# EAGLE design SNES-GamePad (EAGLE 6.2)
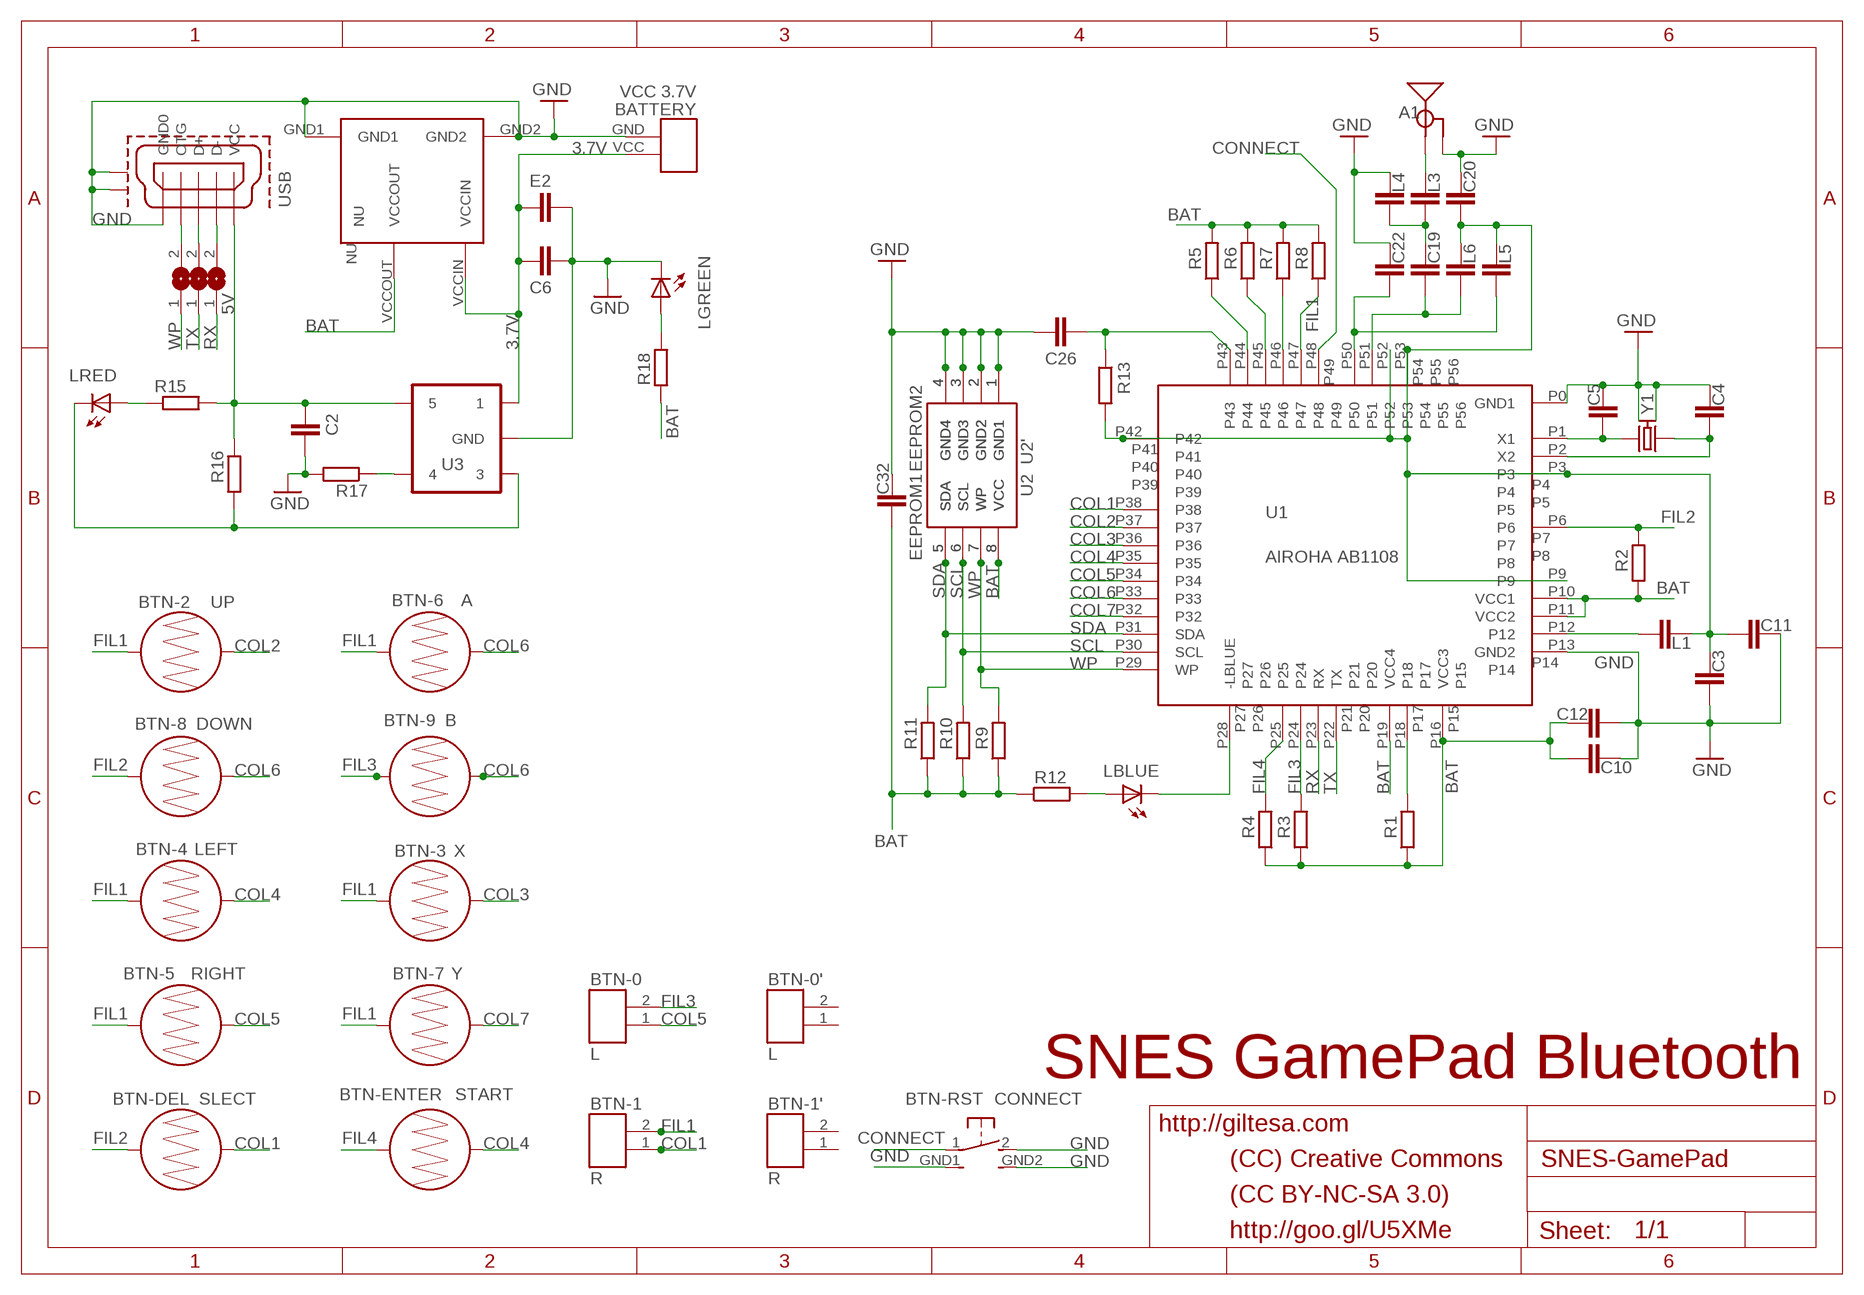
[diagram p0: schematic, sheet 1]

## Parts
A1  ANTENA  ANTENA-AIROHA  [ANTENA-AIROHA]
BATTERY  VCC 3.7V  1X02_SMD_BIG  [1X02_SMD_BIG]
BTN-0  L  1X02_SMD  [1X02_SMD]
BTN-0'  L  SNES_GAMEPAD_RL  [SNES_GAMEPAD_RL]
BTN-1  R  1X02_SMD  [1X02_SMD]
BTN-1'  R  SNES_GAMEPAD_RL  [SNES_GAMEPAD_RL]
BTN-2  UP  BUTTON-CONDUCTIVE-PAD  [BUTTON-CONDUCTIVE-PAD]
BTN-3  X  BUTTON-CONDUCTIVE-BUTTON  [BUTTON-CONDUCTIVE-BUTTON]
BTN-4  LEFT  BUTTON-CONDUCTIVE-PAD  [BUTTON-CONDUCTIVE-PAD]
BTN-5  RIGHT  BUTTON-CONDUCTIVE-PAD  [BUTTON-CONDUCTIVE-PAD]
BTN-6  A  BUTTON-CONDUCTIVE-BUTTON  [BUTTON-CONDUCTIVE-BUTTON]
BTN-7  Y  BUTTON-CONDUCTIVE-BUTTON  [BUTTON-CONDUCTIVE-BUTTON]
BTN-8  DOWN  BUTTON-CONDUCTIVE-PAD  [BUTTON-CONDUCTIVE-PAD]
BTN-9  B  BUTTON-CONDUCTIVE-BUTTON  [BUTTON-CONDUCTIVE-BUTTON]
BTN-DEL  SLECT  BUTTON-CONDUCTIVE-BUTTON  [BUTTON-CONDUCTIVE-BUTTON]
BTN-ENTER  START  BUTTON-CONDUCTIVE-BUTTON  [BUTTON-CONDUCTIVE-BUTTON]
BTN-RST  CONNECT  SWITCH-90º  [SWITCH-90º]
C2  C0603  [C0603]
C3  C0603  [C0603]
C4  C0603  [C0603]
C5  C0603  [C0603]
C6  C0603  [C0603]
C10  C0603  [C0603]
C11  C0603  [C0603]
C12  C0603  [C0603]
C19  C0603  [C0603]
C20  C0603  [C0603]
C22  C0603  [C0603]
C26  C0603  [C0603]
C32  C0603  [C0603]
E2  C0805  [C0805]
L1  C1206  [C1206]
L3  C0603  [C0603]
L4  C0603  [C0603]
L5  C0603  [C0603]
L6  C0603  [C0603]
LBLUE  LEDCHIPLED_0805  [CHIPLED_0805]
LGREEN  LEDCHIPLED_0805  [CHIPLED_0805]
LRED  LEDCHIPLED_0805  [CHIPLED_0805]
R1  22kΩ  R0603  [R0603]
R2  22kΩ  R0603  [R0603]
R3  22kΩ  R0603  [R0603]
R4  22kΩ  R0603  [R0603]
R5  22kΩ  R0603  [R0603]
R6  22kΩ  R0603  [R0603]
R7  22kΩ  R0603  [R0603]
R8  22kΩ  R0603  [R0603]
R9  4.7kΩ  R0603  [R0603]
R10  2.2kΩ  R0603  [R0603]
R11  2.2kΩ  R0603  [R0603]
R12  330Ω  R0603  [R0603]
R13  10Ω  R0603  [R0603]
R15  330Ω  R0603  [R0603]
R16  10kΩ  R0603  [R0603]
R17  4.7kΩ  R0603  [R0603]
R18  1kΩ  R0603  [R0603]
S2  INTERRUPTOR_1  [INTERRUPTOR_1]
SJ1  JUMPER-SMD  [JUMPER-SMD]
SJ2  JUMPER-SMD  [JUMPER-SMD]
SJ3  JUMPER-SMD  [JUMPER-SMD]
U1  AIROHA AB1108  QFN56_6MM  [QFN56_6MM]
U2  EEPROM1  EEPROM-BLUETOOTH-SNES  [TSSOP8]
U2'  EEPROM2  EEPROM-BLUETOOTH-SNES2  [M8-EEPROM]
U3  SOT23-5  [SOT23-5]
USB  MICRO_USB_1  [MICRO_USB_1]
Y1  CRISTAL  CRISTAL-SMD-3X2.5MM  [CRISTAL-SMD-3X2.5MM]

## Nets
3.7V: BATTERY.VCC C6.1 E2.1 S2.VCCIN U3.1
5V: C2.1 R15.2 R16.2 U3.5 USB.VCC
BAT: C10.1 C12.1 C32.2 R1.1 R2.1 R3.1 R4.1 R5.2 R6.2 R7.2 R8.2 R9.1 R10.1 R11.1 R12.1 R18.2 S2.VCCOUT U1.P10(VCC1) U1.P11(VCC2) U1.P16(VCC3) U1.P19(VCC4) U2'.8(VCC) U2.8(VCC)
COL1: BTN-1.1 BTN-DEL.2 U1.P38
COL2: BTN-2.2 U1.P37
COL3: BTN-3.1 U1.P36
COL4: BTN-4.1 BTN-ENTER.1 U1.P35
COL5: BTN-0.1 BTN-5.2 U1.P34
COL6: BTN-6.2 BTN-8.2 BTN-9.2 U1.P33
COL7: BTN-7.2 U1.P32
CONNECT: BTN-RST.1 U1.P48
FIL1: BTN-1.2 BTN-2.1 BTN-3.2 BTN-4.2 BTN-5.1 BTN-6.1 BTN-7.1 R8.1 U1.P47
FIL2: BTN-8.1 BTN-DEL.1 R2.2 U1.P6
FIL3: BTN-0.2 BTN-9.1 R3.2 U1.P24
FIL4: BTN-ENTER.2 R4.2 U1.P25
GND: A1.GND BATTERY.GND BTN-RST.2 BTN-RST.GND1 BTN-RST.GND2 C2.2 C3.2 C4.1 C5.1 C6.2 C10.2 C11.1 C12.2 C20.1 C22.1 C26.2 C32.1 E2.2 L4.1 LGREEN.C R17.2 S2.GND1 S2.GND2 U1.P0(GND1) U1.P13(GND2) U2'.1(GND1) U2'.2(GND2) U2'.3(GND3) U2'.4(GND4) U2.1(GND1) U2.2(GND2) U2.3(GND3) U2.4(GND4) U3.2(GND) USB.GND0 USB.GND1 USB.GND2 Y1.GND1 Y1.GND2
N$1: LRED.A R15.1
N$2: C22.2 L5.2 U1.P50
N$3: SJ1.2 USB.OTG
N$4: LGREEN.A R18.1
N$5: C19.1 L3.2 L4.2
N$6: A1.SIGNAL L3.1
N$7: C19.2 L6.2 U1.P51
N$8: SJ3.2 USB.D-
N$9: SJ2.2 USB.D+
N$35: LBLUE.C U1.P28(-LBLUE)
N$36: LRED.C R16.1 U3.3
N$37: R17.1 U3.4
N$39: LBLUE.A R12.2
N$40: C26.1 R13.1 U1.P43
N$45: C3.1 C11.2 C20.2 L1.2 L5.1 L6.1 R13.2 U1.P3 U1.P9 U1.P42 U1.P52 U1.P53
N$46: R1.2 U1.P18
N$48: R5.1 U1.P44
N$49: R6.1 U1.P45
N$50: R7.1 U1.P46
N$52: L1.1 U1.P12
RX: SJ3.1 U1.P23(RX)
SCL: R10.2 U1.P30(SCL) U2'.6(SCL) U2.6(SCL)
SDA: R11.2 U1.P31(SDA) U2'.5(SDA) U2.5(SDA)
TX: SJ2.1 U1.P22(TX)
WP: R9.2 SJ1.1 U1.P29(WP) U2'.7(WP) U2.7(WP)
X1: C5.2 U1.P1(X1) Y1.P2
X2: C4.2 U1.P2(X2) Y1.P1
Unconnected: BTN-0'.1 BTN-0'.2 BTN-1'.1 BTN-1'.2 S2.NU U1.P4 U1.P5 U1.P7 U1.P8 U1.P14 U1.P15 U1.P17 U1.P20 U1.P21 U1.P26 U1.P27 U1.P39 U1.P40 U1.P41 U1.P49 U1.P54 U1.P55 U1.P56

## Notes on the sheet
- SNES GamePad Bluetooth
- http://giltesa.com
- (CC) Creative Commons
- (CC BY-NC-SA 3.0)
- http://goo.gl/U5XMe

## Library data of the parts
A1 = ,giltesa:ANTENA-AIROHA
BATTERY = ,giltesa:1X02_SMD_BIG
BTN-0 BTN-1 = ,giltesa:1X02_SMD
BTN-0' BTN-1' = ,giltesa:SNES_GAMEPAD_RL
BTN-2 BTN-4 BTN-5 BTN-8 = ,giltesa:BUTTON-CONDUCTIVE-PAD
BTN-3 BTN-6 BTN-7 BTN-9 BTN-DEL BTN-ENTER = ,giltesa:BUTTON-CONDUCTIVE-BUTTON
BTN-RST = ,giltesa:SWITCH-90º
C2-C6 C10-C12 C19 C20 C22 C26 C32 L3-L6 = ,giltesa:C0603
E2 = ,giltesa:C0805
L1 = ,giltesa:C1206
LBLUE LGREEN LRED = led:LED: LED OSRAM: - CHIPLED LG R971, LG N971, LY N971, LG Q971, LY Q971, LO R971, LY R971 LH N974, LH R974 LS Q976, LO Q976, LY Q976 LO Q996 - Hyper CHIPLED LW Q18S LB Q993, LB Q99A, LB R99A - SideLED LS A670, LO A670, LY A670, LG A670, LP A670 LB A673, LV A673, LT A673, LW A673 LH A674 LY A675 LS A676, LA A676, LO A676, LY A676, LW A676 LS A679, LY A679, LG A679 - Hyper Micro SIDELED® LS Y876, LA Y876, LO Y876, LY Y876 LT Y87S - SmartLED LW L88C, LW L88S LB L89C, LB L89S, LG L890 LS L89K, LO L89K, LY L89K LS L896, LA L896, LO L896, LY L896 - TOPLED LS T670, LO T670, LY T670, LG T670, LP T670 LSG T670, LSP T670, LSY T670, LOP T670, LYG T670 LG T671, LOG T671, LSG T671 LB T673, LV T673, LT T673, LW T673 LH T674 LS T676, LA T676, LO T676, LY T676, LB T676, LH T676, LSB T676, LW T676 LB T67C, LV T67C, LT T67C, LS T67K, LO T67K, LY T67K, LW E67C LS E67B, LA E67B, LO E67B, LY E67B, LB E67C, LV E67C, LT E67C LW T67C LS T679, LY T679, LG T679 LS T770, LO T770, LY T770, LG T770, LP T770 LB T773, LV T773, LT T773, LW T773 LH T774 LS E675, LA E675, LY E675, LS T675 LS T776, LA T776, LO T776, LY T776, LB T776 LHGB T686 LT T68C, LB T68C - Hyper Mini TOPLED® LB M676 - Mini TOPLED Santana® LG M470 LS M47K, LO M47K, LY M47K Source: http://www.osram.convergy.de LUXEON: - LUMILED® LXK2-PW12-R00, LXK2-PW12-S00, LXK2-PW14-U00, LXK2-PW14-V00 LXK2-PM12-R00, LXK2-PM12-S00, LXK2-PM14-U00 LXK2-PE12-Q00, LXK2-PE12-R00, LXK2-PE12-S00, LXK2-PE14-T00, LXK2-PE14-U00 LXK2-PB12-K00, LXK2-PB12-L00, LXK2-PB12-M00, LXK2-PB14-N00, LXK2-PB14-P00, LXK2-PB14-Q00 LXK2-PR12-L00, LXK2-PR12-M00, LXK2-PR14-Q00, LXK2-PR14-R00 LXK2-PD12-Q00, LXK2-PD12-R00, LXK2-PD12-S00 LXK2-PH12-R00, LXK2-PH12-S00 LXK2-PL12-P00, LXK2-PL12-Q00, LXK2-PL12-R00 Source: www.luxeon.com KINGBRIGHT: KA-3528ASYC Source: www.kingbright.com
R1-R13 R15-R18 = ,giltesa:R0603
S2 = ,giltesa:INTERRUPTOR_1
SJ1-SJ3 = ,giltesa:JUMPER-SMD
U1 = ,giltesa:QFN56_6MM
U2 = ,giltesa:EEPROM-BLUETOOTH-SNES
U2' = ,giltesa:EEPROM-BLUETOOTH-SNES2
U3 = ,giltesa:SOT23-5
USB = ,giltesa:MICRO_USB_1
Y1 = ,giltesa:CRISTAL-SMD-3X2.5MM

## Board
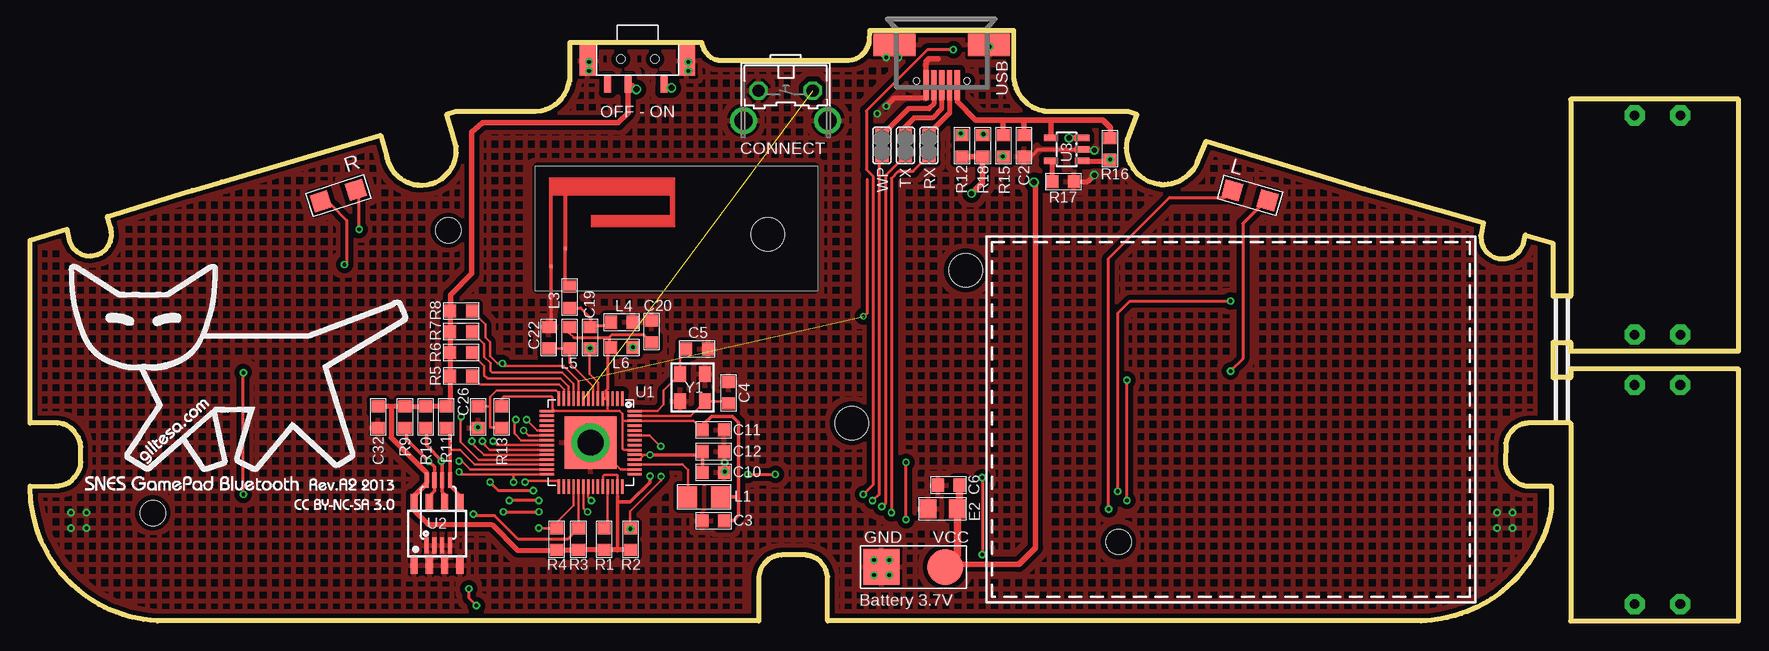
[diagram p1: board, top side]
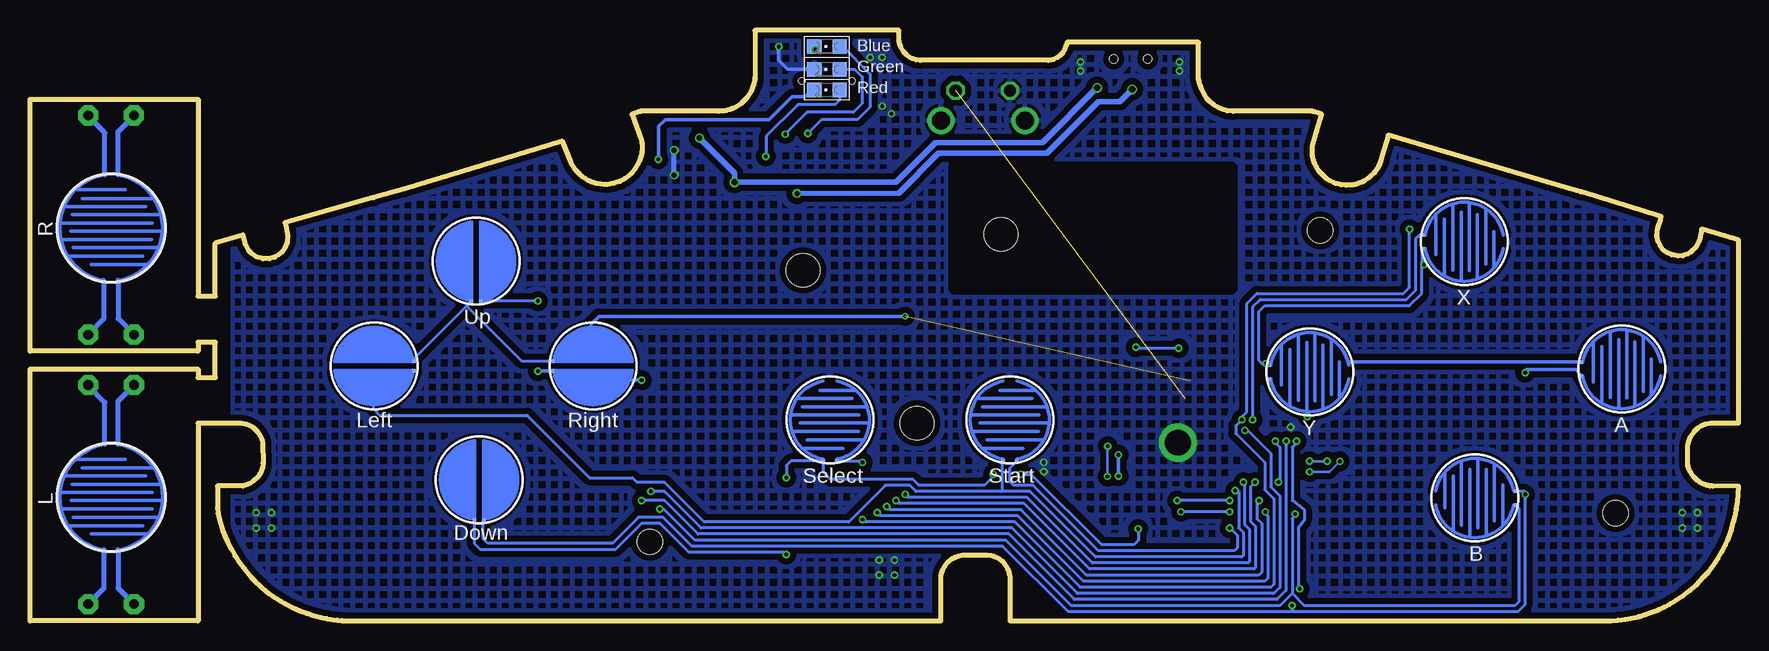
[diagram p2: board, bottom side, seen from below]

Size 142.42 x 49.25 mm. Coordinates in mm from the lower left corner, seen from the top.
Outline: 0,16.48 0,31.75 3.07,32.66 3.28,31.67 3.56,31.14 3.94,30.78 4.22,30.61 4.65,30.45 5.03,30.43 5.59,30.53 5.99,30.73 6.3,30.96 6.53,31.29 6.71,31.62 6.81,32.11 6.78,32.46 6.73,32.77 6.5,33.45 6.45,33.73 13.16,35.79 13.51,35.89 15.95,36.6 29.21,40.49 29.72,38.76 29.77,38.58 29.82,38.38 29.9,38.18 30.12,37.72 30.2,37.62 30.33,37.44 30.43,37.31 30.63,37.11 30.78,36.98 30.91,36.88 31.19,36.7 31.32,36.63 31.52,36.55 31.78,36.45 31.95,36.4 32.08,36.37 32.26,36.35 32.36,36.35 32.72,36.32 33.12,36.37 33.35,36.42 33.55,36.47 33.76,36.55 34.14,36.75 34.32,36.86 34.44,36.96 34.75,37.24 34.98,37.52 35.18,37.85 35.31,38.07 35.43,38.46 35.51,38.79 35.53,39.01 35.53,39.55 35.18,40.77 34.75,42.24 35.51,42.49 42.11,42.49 42.62,42.55 42.95,42.65 43.36,42.8 43.76,43.05 44.07,43.31 44.3,43.56 44.53,43.87 44.75,44.3 44.91,44.75 44.98,45.03 45.01,45.16 45.01,48.25 55.98,48.25 56.03,48.01 56.06,47.96 56.18,47.63 56.34,47.4 56.57,47.14 56.77,46.99 57.07,46.84 57.35,46.76 57.56,46.74 68.22,46.74 68.55,46.79 68.86,46.89 69.11,47.02 69.32,47.17 69.57,47.42 69.67,47.55 69.82,47.83 69.9,48.03 69.95,48.18 69.98,48.34 70,49.25 81.99,49.25 81.99,45.26 82.09,44.7 82.22,44.37 82.32,44.15 82.47,43.89 82.65,43.64 82.93,43.33 83.16,43.13 83.52,42.9 83.79,42.75 84.05,42.65 84.33,42.57 84.58,42.52 85.01,42.49 91.52,42.49 92.25,42.24 91.47,40.16 91.41,39.83 91.39,39.45 91.41,39.14 91.49,38.74 91.57,38.51 91.59,38.38 91.72,38.13 91.97,37.69 92.28,37.31 92.48,37.13 92.84,36.88 93.22,36.65 93.75,36.5 94.11,36.42 94.28,36.4 94.59,36.4 94.87,36.42 95.17,36.47 95.45,36.55 95.66,36.63 95.89,36.73 96.14,36.88 96.37,37.03 96.57,37.21 96.75,37.36 96.9,37.54 97,37.67 97.26,38.07 97.33,38.25 98.04,40.01 111.25,36.02 113.82,35.28 121.16,33.2 120.93,32.13 120.98,31.57 121.16,31.14 121.41,30.76 121.72,30.51 122.02,30.33 122.45,30.2 122.99,30.2 123.55,30.35 123.98,30.66 124.18,30.89 124.46,31.37 124.66,32.18 126.97,31.5 126.97,27.08 128.42,27.08 128.42,43.5 142.42,43.5 142.42,22.5 128.42,22.5 128.42,23.22 126.97,23.22 126.97,20.29 128.42,20.29 128.42,21 142.42,21 142.42,0 128.42,0 128.42,16.48 124.84,16.48 124.61,16.46 124.41,16.41 124.18,16.33 123.88,16.15 123.65,15.98 123.44,15.77 123.24,15.44 123.09,15.11 123.01,14.81 122.99,13.13 123.04,12.78 123.24,12.27 123.42,11.99 123.83,11.63 124.05,11.48 124.49,11.3 124.69,11.25 126.8,11.25 126.8,9.4 126.75,8.94 126.64,8.51 126.34,7.52 126.14,6.99 125.98,6.63 125.7,6.07 125.32,5.41 124.94,4.83 123.98,3.63 123.67,3.33 123.16,2.84 122.78,2.51 122.53,2.31 122.07,1.98 121.79,1.8 121.46,1.6 121.16,1.42 120.62,1.14 120.29,0.99 119.84,0.79 119.33,0.61 118.85,0.46 118.19,0.28 117.65,0.18 116.81,0.05 116.43,0.03 115.98,0 66.5,0 66.5,3.71 66.4,4.09 66.32,4.29 66.19,4.55 65.89,4.93 65.61,5.16 65.33,5.31 65.02,5.41 64.85,5.46 64.67,5.49 62.64,5.49 62.33,5.46 62.1,5.38 61.85,5.28 61.62,5.16 61.42,5 61.19,4.75 60.99,4.47 60.91,4.29 60.86,4.17 60.78,3.86 60.73,3.63 60.73,0 10.64,0 10.06,0.05 9.45,0.13 8.33,0.36 7.72,0.53 7.16,0.74 6.65,0.94 6.17,1.17 5.77,1.37 5.26,1.68 4.65,2.08 4.06,2.54 3.51,3.02 3.23,3.3 2.84,3.71 2.54,4.06 2.29,4.39 1.98,4.8 1.73,5.18 1.4,5.77 1.09,6.32 0.91,6.73 0.61,7.54 0.38,8.33 0.25,8.86 0.18,9.3 0.08,9.93 0,11.23 2.13,11.25 2.36,11.25 2.49,11.28 2.72,11.33 3,11.43 3.25,11.56 3.51,11.73 3.73,11.99 3.91,12.22 4.04,12.45 4.11,12.6 4.22,12.93 4.24,13.23 4.24,14.53 4.19,14.86 4.17,14.96 4.04,15.32 3.66,15.85 3.4,16.08 3.07,16.28 2.77,16.41 2.31,16.48 0,16.48
Copper layers (1*16): Top 0.035mm / dielectric 1.5mm / Bottom 0.035mm
Design rules: minimum track width 6mil, minimum drill 12mil, track to track 6mil, track to pad 6mil, pad to pad 6mil, via to via 6mil, smd to smd 0mil, copper to edge 10mil, drill to drill 10mil, minimum pad ring 10mil, minimum via ring 6mil, stop-mask expansion 2mil, vias tented up to drill 100mil, thermal gap 10mil
Holes 2.8 mm at 61.5,32.24 78,29.24 68.5,16.49
Holes 2.1 mm at 10.25,8.99 90.75,6.59 34.87,32.57

### Footprints (pad centres in the part's own frame; a part is rotated, then mirrored left to right if it is on the bottom)
ANTENA-AIROHA = smd 0.25 x 0.25: GND -10.351,-3.289; SIGNAL -9.152,-1.79
1X02_SMD_BIG = smd 3 x 3: GND -2.75,0; VCC 2.56,0
1X02_SMD = smd 1.5 x 1.5: 1 -1.48,0.02; 2 1.58,0.02
SNES_GAMEPAD_RL = drill 0.8 pad 1.676 octagon: 1 1.27,5.08; 1' 19.55,5.08; 2 1.27,1.27; 2' 19.55,1.27
BUTTON-CONDUCTIVE-PAD = smd 0.305 x 0.305: 1 -3.334,0.396; 2 -3.334,-0.396
BUTTON-CONDUCTIVE-BUTTON = smd 0.305 x 0.305: 1 3.41,-0.577; 2 3.412,0.577
SWITCH-90º = drill 1.016 octagon: 1 -2.261,-1.245; 2 2.261,-1.245 | drill 1.499 pad 2.159: GND1 -3.505,1.245; GND2 3.505,1.245
C0603 = smd 1 x 1.1: 1 -0.901,-0.038; 2 0.901,-0.038
C0805 = smd 1.4 x 1.6: 1 -1.256,-0.025; 2 1.193,-0.025
C1206 = smd 1.6 x 1.8: 1 -1.362,-0.013; 2 1.387,-0.013
CHIPLED_0805 = smd 1.2 x 1.2: A 0,-1.05; C 0,1.05
R0603 = smd 1 x 1.1: 1 -0.901,0.013; 2 0.901,0.013
INTERRUPTOR_1 = smd 1.4 x 2.54: GND1 -0.75,1.232; GND2 7.5,1.232 | smd 0.6 x 1.4: NU 0.9,-0.75; VCCIN 5.6,-0.75; VCCOUT 2.6,-0.75 | hole 0.7: 2,1.36; 4.85,1.36
JUMPER-SMD = smd 1.15 x 1.1: 1 -0.838,0; 2 0.838,0
QFN56_6MM = smd 4.35 x 4.35: P0 0.004,-0.123 | smd 1.2 x 0.203: P1 3.658,2.515; P2 3.658,2.108; P3 3.658,1.702; P4 3.658,1.295; P5 3.658,0.889; P6 3.658,0.483; P7 3.658,0.076; P8 3.658,-0.33; P9 3.658,-0.737; P10 3.658,-1.143; P11 3.658,-1.549; P12 3.658,-1.956; P13 3.658,-2.362; P14 3.658,-2.769; P29 -3.658,-2.769; P30 -3.658,-2.362; P31 -3.658,-1.956; P32 -3.658,-1.549; P33 -3.658,-1.143; P34 -3.658,-0.737; P35 -3.658,-0.33; P36 -3.658,0.076; P37 -3.658,0.483; P38 -3.658,0.889; P39 -3.658,1.295; P40 -3.658,1.702; P41 -3.658,2.108; P42 -3.658,2.515 | smd 0.203 x 1.2: P15 2.642,-3.785; P16 2.235,-3.785; P17 1.829,-3.785; P18 1.422,-3.785; P19 1.016,-3.785; P20 0.61,-3.785; P21 0.203,-3.785; P22 -0.203,-3.785; P23 -0.61,-3.785; P24 -1.016,-3.785; P25 -1.422,-3.785; P26 -1.829,-3.785; P27 -2.235,-3.785; P28 -2.642,-3.785; P43 -2.642,3.531; P44 -2.235,3.531; P45 -1.829,3.531; P46 -1.422,3.531; P47 -1.016,3.531; P48 -0.61,3.531; P49 -0.203,3.531; P50 0.203,3.531; P51 0.61,3.531; P52 1.016,3.531; P53 1.422,3.531; P54 1.829,3.531; P55 2.235,3.531; P56 2.642,3.531
TSSOP8 = smd 1.3 x 0.35: 1 -2.722,0.975; 2 -2.722,0.325; 3 -2.722,-0.325; 4 -2.722,-0.975; 5 2.722,-0.975; 6 2.722,-0.325; 7 2.722,0.325; 8 2.722,0.975
M8-EEPROM = smd 0.6 x 1.4: 1 -1.905,-2.63; 2 -0.635,-2.63; 3 0.635,-2.63; 4 1.905,-2.63; 5 1.905,2.63; 6 0.635,2.63; 7 -0.635,2.63; 8 -1.905,2.63
SOT23-5 = smd 1.2 x 0.55: 1 1.3,0.955; 2 1.3,0; 3 1.3,-0.955; 4 -1.3,-0.955; 5 -1.3,0.955
MICRO_USB_1 = smd 2.5 x 0.45: D+ 3.35,0; D- 3.35,0.65; GND0 3.35,-1.3; OTG 3.35,-0.65; VCC 3.35,1.3 | smd 1.9 x 3.5: GND1 0,3.95; GND2 0,-3.95 | hole 0.5: 3,2.1; 3,-2.1
CRISTAL-SMD-3X2.5MM = smd 1.3 x 1: GND1 -1.046,0.886; GND2 1.237,-1.196; P1 -1.046,-1.196; P2 1.237,0.886

### Placement (x,y rotation side)
A1  53.77,32.85 0 top
BATTERY  73.75,4.49 0 top
BTN-0  101.75,35.49 164 top
BTN-0'  132.49,0.12 90 bottom
BTN-1  25.75,35.49 198 top
BTN-1'  132.49,22.6 90 bottom
BTN-2  105.25,29.99 90 bottom
BTN-3  22.87,31.62 180 bottom
BTN-4  113.75,21.24 180 bottom
BTN-5  95.5,21.24 0 bottom
BTN-6  9.75,20.99 180 bottom
BTN-7  35.75,20.74 180 bottom
BTN-8  105,11.74 90 bottom
BTN-9  22,10.24 0 bottom
BTN-DEL  75.75,16.74 270 bottom
BTN-ENTER  60.75,16.74 270 bottom
BTN-RST  62.99,42.98 180 top
C2  82.91,39.62 270 top
C3  56.97,8.31 180 top
C4  58.27,19.02 270 top
C5  55.6,22.63 180 top
C6  76.58,11.28 180 top
C10  56.97,12.42 0 top
C11  56.97,15.87 180 top
C12  56.97,14.15 0 top
C19  46.74,23.62 270 top
C20  51.84,24.13 270 top
C22  43.28,23.62 270 top
C26  37.39,16.99 270 top
C32  28.98,16.99 90 top
E2  76.05,9.32 180 top
L1  56.18,10.34 0 top
L3  45.01,27 270 top
L4  49.33,24.87 180 top
L5  45.01,23.62 270 top
L6  49.33,22.83 0 top
LBLUE  76,47.92 90 bottom
LGREEN  76,46 90 bottom
LRED  76,44.27 90 bottom
R1  47.88,6.81 90 top
R2  50.06,6.81 90 top
R3  45.72,6.81 90 top
R4  43.92,6.81 90 top
R5  35.94,20.42 180 top
R6  35.94,22.4 180 top
R7  35.94,24.13 180 top
R8  35.94,25.86 180 top
R9  31.24,16.99 270 top
R10  32.97,16.99 270 top
R11  34.68,16.99 270 top
R12  77.7,39.62 90 top
R13  39.32,16.99 90 top
R15  81.15,39.62 90 top
R16  90.04,39.37 90 top
R17  86.13,36.63 0 top
R18  79.4,39.62 270 top
S2  47.25,45.49 0 top
SJ1  71.02,39.65 90 top
SJ2  72.97,39.65 90 top
SJ3  74.93,39.65 90 top
U1  46.74,14.99 0 top
U2  34.04,9.02 90 top
U2'  33.93,7.26 0 top
U3  86.41,39.31 0 top
U$1  [SNES-LOGO]  2.82,29.11 0 top
USB  76,48.03 270 top
Y1  55.09,19.35 90 top

### Tracks (layer width: path | path; a pad name or v marks a point on that pad's centre or on a via)
3.7V  (via drill 0.46, 0.51)
  Top 0.457: S2.VCCIN 52.85,44.59 | 52.85,44.59 52.77,44.51 | U3.1 87.37,40.27 v86.61,40.26 | 76.51,4.7 82.42,4.7 83.82,6.1 83.82,36.45 v83.69,36.58 | 52.85,44.59 53.33,44.59 v53.47,44.45
  Top 0.508: 52.88,44.7 S2.VCCIN
  Top 0.61: E2.1 77.3,5.49 BATTERY.VCC 76.51,4.7 | C6.1 77.48,9.53
  Top 0.635: 77.48,9.53 E2.1
  Bottom 0.457: v86.61,40.26 83.69,37.34 v83.69,36.58 70.23,36.58 66.93,39.88 58.04,39.88 v53.47,44.45
5V
  Top 0.406: 83.12,40.27 C2.1 | 90.02,40.26 R16.2
  Top 0.457: 81.05,41.76 82.68,41.76 | 82.68,41.76 85.22,41.76 | 85.22,41.76 89.43,41.76 90.04,41.15 R16.2 | 81.05,41.76 81.09,41.72 81.09,40.58 R15.2 | C2.1 82.87,41.57 82.68,41.76 | U3.5 85.11,41.7 85.22,41.76 | USB.VCC 77.3,43.28 78.82,41.76 81.05,41.76
BAT  (via drill 0.3, 0.41, 0.51)
  Top 0.203: U1.P19 47.75,12.07 47.88,12.19 48.9,12.19 48.97,12.12 U1.P16 48.97,10.41 | 55.8,13.84 C12.1 | 56.03,13.44 C10.1 | U1.P10 51.18,13.84 | 51.18,13.84 v51.69,13.84 | U1.P11 50.77,13.44 51.18,13.84
  Top 0.305: 48.97,10.41 48.97,9.91 | 48.97,9.91 48.97,5.91 | C12.1 C10.1 | v51.69,12.07 51.69,11.56 50.04,9.91 48.97,9.91 | 55.8,13.84 v51.69,13.84 | 33.05,11.46 33.05,11.72 U2.8
  Top 0.406: R8.2 R7.2 R6.2 R5.2 35.04,17.93 R11.1 R10.1 R9.1 30.1,17.89 | 30.1,17.89 C32.2 | R2.1 48.97,5.91 R1.1 R3.1 R4.1 | 30.1,17.89 30.1,15.29 33.05,12.34 33.05,11.46 32.03,10.44 U2'.8 32.03,9.17 33.17,8.03 38.51,8.03 40.67,5.87 43.87,5.87 R4.1 | 43.61,6.2 R4.1
  Top 0.457: S2.VCCOUT 49.85,44.64 | 49.85,44.64 50.23,44.64 v50.55,44.32 | 49.85,44.64 49.85,42.35 49.02,41.53 37.72,41.53 36.83,40.77 36.83,28.96 35.05,27.18 35.05,25.86 R8.2 | R12.1 R18.2 79.41,36.56 v78.49,35.64
  Bottom 0.305: v51.69,13.84 v51.69,12.07
  Bottom 0.457: v78.49,35.64 69.98,35.69 66.68,38.99 57.66,38.99 53.34,43.31 51.56,43.31 v50.55,44.32
COL1  (via drill 0.3)
  Top 0.203: U1.P38 42.29,15.88 v41.4,16.76
  Top 0.254: BTN-1.1 27.43,35.66 v27.43,32.64 | v73.03,8.43 v73.03,13.21
  Top 0.305: BTN-1.1 27.19,35.93 27.56,35.56
  Bottom 0.254: v27.43,32.64 27.43,27.81 27.94,27.31 40.13,27.31 41.02,26.42 41.02,17.4 41.4,17.02 v41.4,16.76 41.91,16.26 41.91,15.62 39.5,13.21 39.5,10.92 38.74,10.16 38.74,3.05 38.99,2.79 54.86,2.79 60.33,8.26 73.03,8.26 v73.03,8.43 | BTN-DEL.2 73.15,13.33 v73.03,13.21
COL2  (via drill 0.3)
  Top 0.203: U1.P37 41.55,15.47 v41.15,15.88
  Top 0.254: v100.08,26.67 91.69,26.67 90.68,25.65 v90.68,10.8
  Bottom 0.254: v100.08,26.67 104.84,26.67 | v41.15,15.88 40.89,15.88 38.99,13.97 38.99,11.18 38.23,10.41 38.23,2.79 38.74,2.29 55.12,2.29 60.58,7.75 86.49,7.75 89.54,10.8 v90.68,10.8
  Bottom 0.305: 104.84,26.67 BTN-2.2
COL3  (via drill 0.3)
  Top 0.203: U1.P36 40.94,15.06 40.39,15.62 40.39,16.64 v40.51,16.76
  Bottom 0.254: BTN-3.1 26.61,32.19 26.92,31.88 26.92,27.56 27.69,26.8 39.88,26.8 40.51,26.16 v40.51,16.76
COL4  (via drill 0.3)
  Top 0.203: v38.61,14.99 38.94,14.66 U1.P35
  Top 0.254: v38.35,11.56 39.04,10.87 v41.96,10.87
  Bottom 0.254: v38.61,14.99 38.61,14.86 38.23,14.48 38.23,11.68 v38.35,11.56 | v41.96,10.87 41.78,10.92 41.66,10.8 41.66,7.75 41.28,7.37 41.28,5.46 41.4,5.33 53.59,5.33 59.06,10.8 61.47,10.8 | BTN-ENTER.1 61.34,13.31 61.34,10.92 61.47,10.8 | 61.47,10.8 68.58,10.8 69.09,11.3 71.12,11.3 74.17,8.26 86.23,8.26 89.54,11.56 91.82,11.56 92.2,11.94 95.76,11.94 100.97,17.15 113.28,17.15 113.79,17.65 113.79,18.92 113.03,19.69 111.57,19.69 BTN-4.1
COL5  (via drill 0.3)
  Top 0.203: U1.P34 38.33,14.25 38,14.58 37.8,14.81 v37.72,14.99
  Top 0.254: 101.09,33.15 101.09,21.84 v100.08,20.83 | v91.44,10.03 v91.44,20.07
  Top 0.305: BTN-0.1 103.01,35.06 101.09,33.15
  Bottom 0.254: v37.72,14.99 37.72,2.54 38.48,1.78 55.37,1.78 60.83,7.24 86.74,7.24 89.54,10.03 v91.44,10.03
  Bottom 0.305: v100.08,20.83 98.85,20.83 BTN-5.2 94.51,20.85 93.75,20.09 91.47,20.09 v91.44,20.07
COL6  (via drill 0.3)
  Top 0.203: U1.P33 37.85,13.84 37.12,14.57 36.87,14.8 v36.83,14.99
  Top 0.254: v17.78,10.54 v17.78,20.7 | v36.58,2.67 36.58,1.91 v37.21,1.27
  Bottom 0.254: v36.83,14.99 36.78,14.94 36.78,14.91 37.21,14.48 37.21,10.03 36.2,9.27 36.2,8.38 36.7,7.75 36.7,2.79 v36.58,2.67 | 37.21,0.76 18.42,0.76 17.78,1.4 v17.78,10.54 17.88,10.82 BTN-9.2 | 37.21,0.76 55.88,0.76 61.34,6.22 87.25,6.22 89.66,8.64 91.69,8.64 93.85,6.48 104.27,6.48 104.65,6.86 104.65,8.36 BTN-8.2 | v37.21,1.27 37.21,0.76
  Bottom 0.305: BTN-6.2 13.16,20.52 13.59,20.96 17.65,20.96 17.78,20.83 v17.78,20.7
COL7  (via drill 0.3)
  Top 0.203: U1.P32 37.41,13.44 35.92,14.94 35.92,16.99 v35.94,17.02
  Bottom 0.203: 36.08,17.53 arc45 37.88,18.27 38.15,18.54 38.71,19.15 38.86,19.71 BTN-7.2
  Bottom 0.254: v35.94,17.02 35.94,17.38 36.08,17.53
CONNECT  (1 unrouted)
FIL1  (via drill 0.25, 0.3)  (1 unrouted)
  Top 0.203: R8.1 37.97,24.71 37.97,23.62 38.35,23.24 38.35,22.1 38.99,21.46 v39.37,21.46 39.47,21.23 44.48,21.23 45.72,19.99 U1.P47
  Top 0.254: v26.21,29.72 26.42,29.92 26.42,33.4 25.15,34.67 24.56,34.67 BTN-1.2 | 69.77,36.83 69.77,25.65 v69.47,25.4
  Top 0.305: 24.28,34.39 24.28,34.95 BTN-1.2
  Bottom 0.203: BTN-7.1 39.35,21.32 v39.37,21.46
  Bottom 0.254: 32.51,21.49 32.77,22.2 33.12,22.76 33.73,23.37 34.24,23.67 34.8,23.93 35.26,24.03 36.22,24.03 36.68,23.93 37.03,23.77 37.54,23.52 37.9,23.27 38.15,23.01 38.46,22.66 38.81,21.95 38.91,21.59 38.99,21.34 v39.37,21.46 39.75,21.46 40.01,21.72 40.01,25.78 39.5,26.29 27.43,26.29 26.42,27.31 26.42,29.51 v26.21,29.72 26.42,29.92 26.42,30.86 26.29,30.99 BTN-3.2 | 32.51,21.49 32.51,21.34 | 32.43,21.57 32.51,21.49 | 110.41,21.89 106.03,26.27 101.39,21.64 BTN-5.1
  Bottom 0.305: BTN-6.1 32.43,21.57 | BTN-4.2 110.41,21.89 | 106.03,26.27 BTN-2.1 | BTN-5.1 98.38,21.64 95.63,24.38 95.63,24.77 95,25.4 v69.47,25.4
FIL2  (via drill 0.3)
  Top 0.203: 50.04,7.72 50.27,7.72 | U1.P6 51.66,15.47 v52.58,14.55 | v52.6,12.04 52.6,11.71 50.04,9.14 50.04,7.72 | 50.04,7.72 R2.2
  Top 0.254: 50.27,7.72 50.14,7.72 v50.04,7.67 | v79.38,11.94 v79.38,5.54 | v59.84,12.22 v62.13,12.22
  Bottom 0.203: BTN-DEL.1 | v52.6,12.04 52.6,14.48 v52.58,14.55
  Bottom 0.254: 50.04,7.75 v50.04,7.67 50.04,6.73 50.42,6.35 53.09,6.35 58.93,12.19 59.94,12.19 v59.84,12.22 | v79.38,11.94 79.38,12.95 79,13.33 BTN-DEL.1 76.32,12.44 75.69,11.81 68.83,11.81 68.33,11.3 62.87,11.3 62.13,12.04 v62.13,12.22 | v79.38,5.54 79.5,5.59 79.63,5.72 87.5,5.72 89.92,8.13 91.44,8.13 93.6,5.97 104.9,5.97 105.39,6.46 BTN-8.1
FIL3  (via drill 0.3)
  Top 0.203: U1.P24 45.72,7.72 R3.2
  Top 0.254: v36.96,8.89 36.96,8.76 38.74,8.76 40.69,6.81 44.81,6.81 R3.2 | v89.92,9.32 89.92,30.23 95,35.31 99.62,35.31 BTN-0.2
  Top 0.305: 99.82,35.69 99.7,35.81 100.13,35.81 BTN-0.2
  Bottom 0.254: v36.96,8.89 37.21,8.51 37.21,2.29 | 37.21,2.29 38.23,1.27 55.63,1.27 61.09,6.73 87,6.73 89.54,9.27 v89.92,9.32 | BTN-9.1 18.29,9.37 18.29,1.65 18.67,1.27 36.2,1.27 37.21,2.29
FIL4  (via drill 0.3)
  Top 0.203: U1.P25 45.31,9.63 43.94,8.26 43.94,7.75 R4.2 | 43.69,7.49 R4.2 | R4.2 42.46,7.71 v42.42,7.75
  Bottom 0.254: v42.42,7.75 41.78,7.11 41.78,6.1 42.04,5.84 53.34,5.84 58.8,11.3 60.45,11.3 60.73,11.58 60.73,12.77 BTN-ENTER.2 60.2,13.3
GND  (via drill 0.3, 0.41, 2.16)
  Top 0.203: U1.P13 49.23,12.62 47.37,14.48 47.13,14.48 U1.P0 | 57.81,12.45 C10.2
  Top 0.305: C2.2 83.43,38.72 84.02,39.31 U3.2 | v80.01,47.88 80.01,47.97 USB.GND1 | 42.91,24.86 C22.1 43.42,24.7 A1.GND | v70.36,5.08 70.41,5.08
  Top 0.406: v88.72,39.24 87.78,39.24 U3.2 | R17.2 88.18,36.64 v88.72,37.19 | USB.GND1 79.73,48.03 78.99,48.77 | 72.78,48.77 USB.GND2 71.95,48.13 71.25,48.13 70.99,47.88 | 74.7,45.38 USB.GND0 74.7,43.59 72.03,43.59 v71.37,42.93 | 70.41,5.08 71,5.08 BATTERY.GND
  Top 0.457: 74.7,45.38 74.7,46.63 74.93,46.86 75.69,46.86 | 70.99,47.88 70.99,47.37 v71.37,46.99
  Top 0.508: USB.GND2 72.92,48.03 73.53,48.64 73.41,48.64
  Top 0.635: 79.34,48.64 USB.GND1
  Bottom 0.305: LGREEN.C 79.27,46 80.01,46.74 v80.01,47.88
  Bottom 0.406: v88.72,37.19 v88.72,39.24
  other vias: 46.74,14.86 37.34,16.15 57.91,12.45 57.91,13.21 71.63,5.08 71.63,3.81 70.36,3.81 72.39,46.99 122.3,9.02 123.57,9.02 123.57,7.75 122.3,7.75 3.43,9.02 4.7,9.02 4.7,7.75 3.43,7.75 46.61,46.61 54.86,46.61 46.61,45.85 54.86,45.85 70.61,42.29
  pour Top (isolate 0.406, hatched): -1.52,-1.78 125.48,-2.29 125.48,32.51 92.46,43.94 87.38,43.94 arc-90 83.57,47.75 83.57,51.56 42.93,51.56 42.93,47.75 arc-90 39.12,43.94 35.31,43.94 -1.52,32.51
  pour Bottom (isolate 0.508, hatched): -2.79,-3.05 125.48,-3.05 125.48,33.78 92.46,45.21 88.65,45.21 arc-90 84.84,49.02 84.84,52.83 41.66,52.83 41.66,49.02 arc-90 37.85,45.21 35.31,45.21 -2.79,33.78
N$1  (via drill 0.3)
  Top 0.305: R15.1 80.91,38.6 v81.08,38.74
  Bottom 0.254: LRED.A 74.95,43.42 75.31,43.05 78.41,43.05 81.05,40.41 81.05,38.76 v81.08,38.74
N$2
  Top 0.203: U1.P50 46.94,19.53 44.98,21.49 44.98,22.71 L5.2 | 44.96,22.71 L5.2 | L5.2 C22.2
N$3
  Top 0.406: USB.OTG 75.35,43.09 74.96,42.7 73.23,42.7 SJ1.2
N$4  (via drill 0.3)
  Top 0.305: R18.1 79.06,40.19 v79.48,40.59
  Bottom 0.254: 74.92,45.97 73.66,45.97 73.03,45.34 73.03,43.18 73.79,42.42 77.65,42.42 v79.48,40.59 79.4,40.67
  Bottom 0.305: 74.92,45.97 LGREEN.A
N$5
  Top 0.254: L3.2 45.91,26.1 46.74,25.27 46.74,24.56 C19.1 46.83,24.65 48.17,24.65 L4.2
N$6
  Top 0.305: A1.SIGNAL 44.62,28.26 L3.1
N$7  (via drill 0.3)
  Top 0.203: U1.P51 47.35,19.89 46.63,20.6 46.63,22.68 v46.69,22.73 | 46.61,22.63 C19.2
  Top 0.254: C19.2 46.55,22.72 v46.69,22.73 | v50.24,22.81 50.11,22.81 L6.2
  Bottom 0.254: v46.69,22.73 50.17,22.73 v50.24,22.81
N$8
  Top 0.406: USB.D- 76.65,42.36 75.34,41.05 74.83,40.51 SJ3.2
N$9
  Top 0.406: USB.D+ 76,42.72 75.21,41.94 73.69,41.94 72.92,41.17 72.92,40.54 SJ2.2
N$35  (via drill 0.3)
  Top 0.203: U1.P28 44.09,11.53 43.94,11.68 41.4,11.68 v41.28,11.56
  Top 0.254: v76.96,47.63 74.8,47.63 69.72,42.55 69.72,37.64 70.28,37.08 70.28,11.35 v69.47,10.54
  Bottom 0.254: v41.28,11.56 41.15,11.43 41.15,8 40.77,7.62 40.77,4.95 40.89,4.83 53.85,4.83 59.31,10.29 69.22,10.29 v69.47,10.54
  Bottom 0.305: LBLUE.C 77,47.92 v76.96,47.63
N$36  (via drill 0.3)
  Top 0.305: v90.04,38.48 | v90.04,38.48 R16.1
  Top 0.406: U3.3 89.92,38.36 R16.1
  Bottom 0.305: v90.04,38.48 90.04,41.28 89.46,41.81 80.8,41.81 78.89,43.71 77.88,43.71 77.85,43.69 77.27,44.27 LRED.C
N$37
  Top 0.406: R17.1 85.23,38.24 U3.4
N$39  (via drill 0.3)
  Top 0.254: R12.2 77.66,40.58 v77.6,40.64
  Bottom 0.254: 74.71,47.92 72.39,45.59 72.39,42.85 73.43,41.81 76.43,41.81 v77.6,40.64 77.62,40.92
  Bottom 0.305: LBLUE.A 74.71,47.92
N$40
  Top 0.203: 38.35,17.91 38.35,18.67 38.89,19.2 43.84,19.2 44.09,18.95 U1.P43 | 38.35,17.91 38.35,16.13 38.89,16.13 R13.1 | C26.1 38.34,17.89 38.35,17.91
N$45
  Top 0.203: C20.2 51.8,23.38 | U1.P9 49.5,14.25 49.4,14.35 49.4,16.76 | 49.4,16.76 49.4,17.27 49.15,17.53 48.13,17.53 | 48.13,17.53 43.69,17.53 | 43.69,17.53 43.1,17.53 U1.P42 | U1.P53 48.16,17.55 48.13,17.53 | 49.4,16.76 49.48,16.69 U1.P3 55.3,16.69 C11.2 | 38.94,17.5 R13.2 | 43.69,17.53 43.56,17.65 43.56,18.59 43.46,18.69 39.52,18.69 39.27,18.44 39.27,17.93 R13.2 | 39.24,17.96 R13.2 | 48.16,22.53 L6.1 | 45.34,23.62 44.96,24 44.96,24.51 L5.1 | U1.P53 U1.P52 | 48.01,18.67 U1.P53
  Top 0.254: C11.2 56.07,16.19 | 57.91,8.38 C3.1 | 45.34,23.62 48.26,23.62 | 48.26,23.62 48.51,23.88 51.16,23.88 C20.2 | 48.26,23.62 48.26,22.96 L6.1 | 48.16,22.53 48.16,19.33 48.01,19.18 48.01,18.67
  Top 0.305: 57.91,8.38 58.67,8.38 59.08,8.79 59.08,10.31 | 59.08,10.31 59.08,16.54 58.57,17.04 56.79,17.04 56.16,16.41 56.16,16 C11.2 | L1.2 59.07,10.33 59.08,10.31
N$46
  Top 0.203: U1.P18 48.16,8.13 R1.2
N$48
  Top 0.203: 37,20.41 R5.1 37.54,19.71 44.09,19.71 44.5,19.3 U1.P44
N$49
  Top 0.203: 36.84,22.34 R6.1 37.24,22 37.24,21.87 37.87,21.23 37.87,20.47 38.13,20.22 44.22,20.22 44.91,19.53 U1.P45
N$50
  Top 0.203: 36.97,24.12 R7.1 37.87,23.09 37.87,22 38.38,21.49 38.38,20.85 38.51,20.73 44.35,20.73 45.31,19.76 U1.P46
N$52
  Top 0.203: U1.P12 54.41,13.03 54.86,12.57 54.86,10.37 L1.1
RX  (via drill 0.3)
  Top 0.203: U1.P23 46.13,9.37 v46.48,9.09
  Top 0.254: v39.45,9.09 v42.42,9.09 | v71.81,9.02 71.81,36.88 72.42,37.49 73.61,37.49 SJ3.1
  Bottom 0.254: v39.45,9.09 39.24,8.76 39.24,3.56 39.5,3.3 54.61,3.3 60.07,8.76 71.5,8.76 v71.81,9.02 | v42.42,9.09 v46.48,9.09
SCL  (via drill 0.3)
  Top 0.203: U1.P30 36.7,12.62 36.02,13.31 v35.76,13.31
  Top 0.305: 33.02,16 R10.2 33.05,16.03 33.05,14.63 34.36,13.31 v34.28,13.31 34.36,13.23 U2.6 34.36,10.77 34.57,10.57 U2'.6
  Bottom 0.203: 34.44,13.39 v34.28,13.31 v35.76,13.31
SDA
  Top 0.203: U1.P31 37.06,13.03 35.84,14.25 35.01,14.25
  Top 0.305: 34.93,15.99 R11.2 35.01,15.78 35.01,14.25 U2.5 35.01,11.27 35.84,10.44 U2'.5
TX  (via drill 0.3)
  Top 0.203: U1.P22 46.53,10.29 v46.79,10.03
  Top 0.254: v42.42,10.03 v39.95,10.03 | v70.99,9.53 71.3,9.78 71.3,37.13 SJ2.1
  Bottom 0.254: v39.95,10.03 40.13,9.91 40.13,8.51 39.75,8.13 39.75,4.06 40.01,3.81 54.36,3.81 59.82,9.27 70.74,9.27 v70.99,9.53 | v42.42,10.03 v46.79,10.03
WP  (via drill 0.3)
  Top 0.203: U1.P29 40.39,12.22 | 40.39,12.22 35.92,12.22 v35.76,12.42 | v40.31,11.56 40.31,12.14 40.39,12.22
  Top 0.254: v70.23,10.03 70.79,10.54 70.79,38.58 SJ1.1
  Top 0.305: 31.37,16.08 R9.2 31.39,15.95 31.39,15.14 v33.24,13.3 33.71,12.82 U2.7 33.71,10.85 33.3,10.44 U2'.7
  Bottom 0.203: v35.76,12.42 34.11,12.42 v33.24,13.3
  Bottom 0.254: v40.31,11.56 40.64,11.23 40.64,8.26 40.26,7.87 40.26,4.45 40.39,4.32 54.1,4.32 59.56,9.78 69.98,9.78 v70.23,10.03
X1
  Top 0.203: U1.P1 52.3,17.5 52.83,18.03 52.83,19.22 Y1.P2 54.21,22.18 C5.2
X2
  Top 0.203: U1.P2 55.07,17.09 Y1.P1 58.05,18.31 C4.2

### Text on the board
tPlace: USB | OFF - ON | L | R | WP | TX | RX | GND | VCC | Battery 3.7V
bPlace: Blue | Green | Red | X | Up | A | Y | Right | Left | Start | Select | Down | B
tDocu: Button0 | Button1
bDocu: Button3 S41 | Button2 S42 | Button7 S21 | Button6 S16 | Button5 S31 | Button4 S32 | ButtonDelete S20 | ButtonEnter S4 | Button8 S11 | Button9 S6